# EAGLE design stm32f103cb_lcd32 (EAGLE 6.6.0)
LCD demo module strip
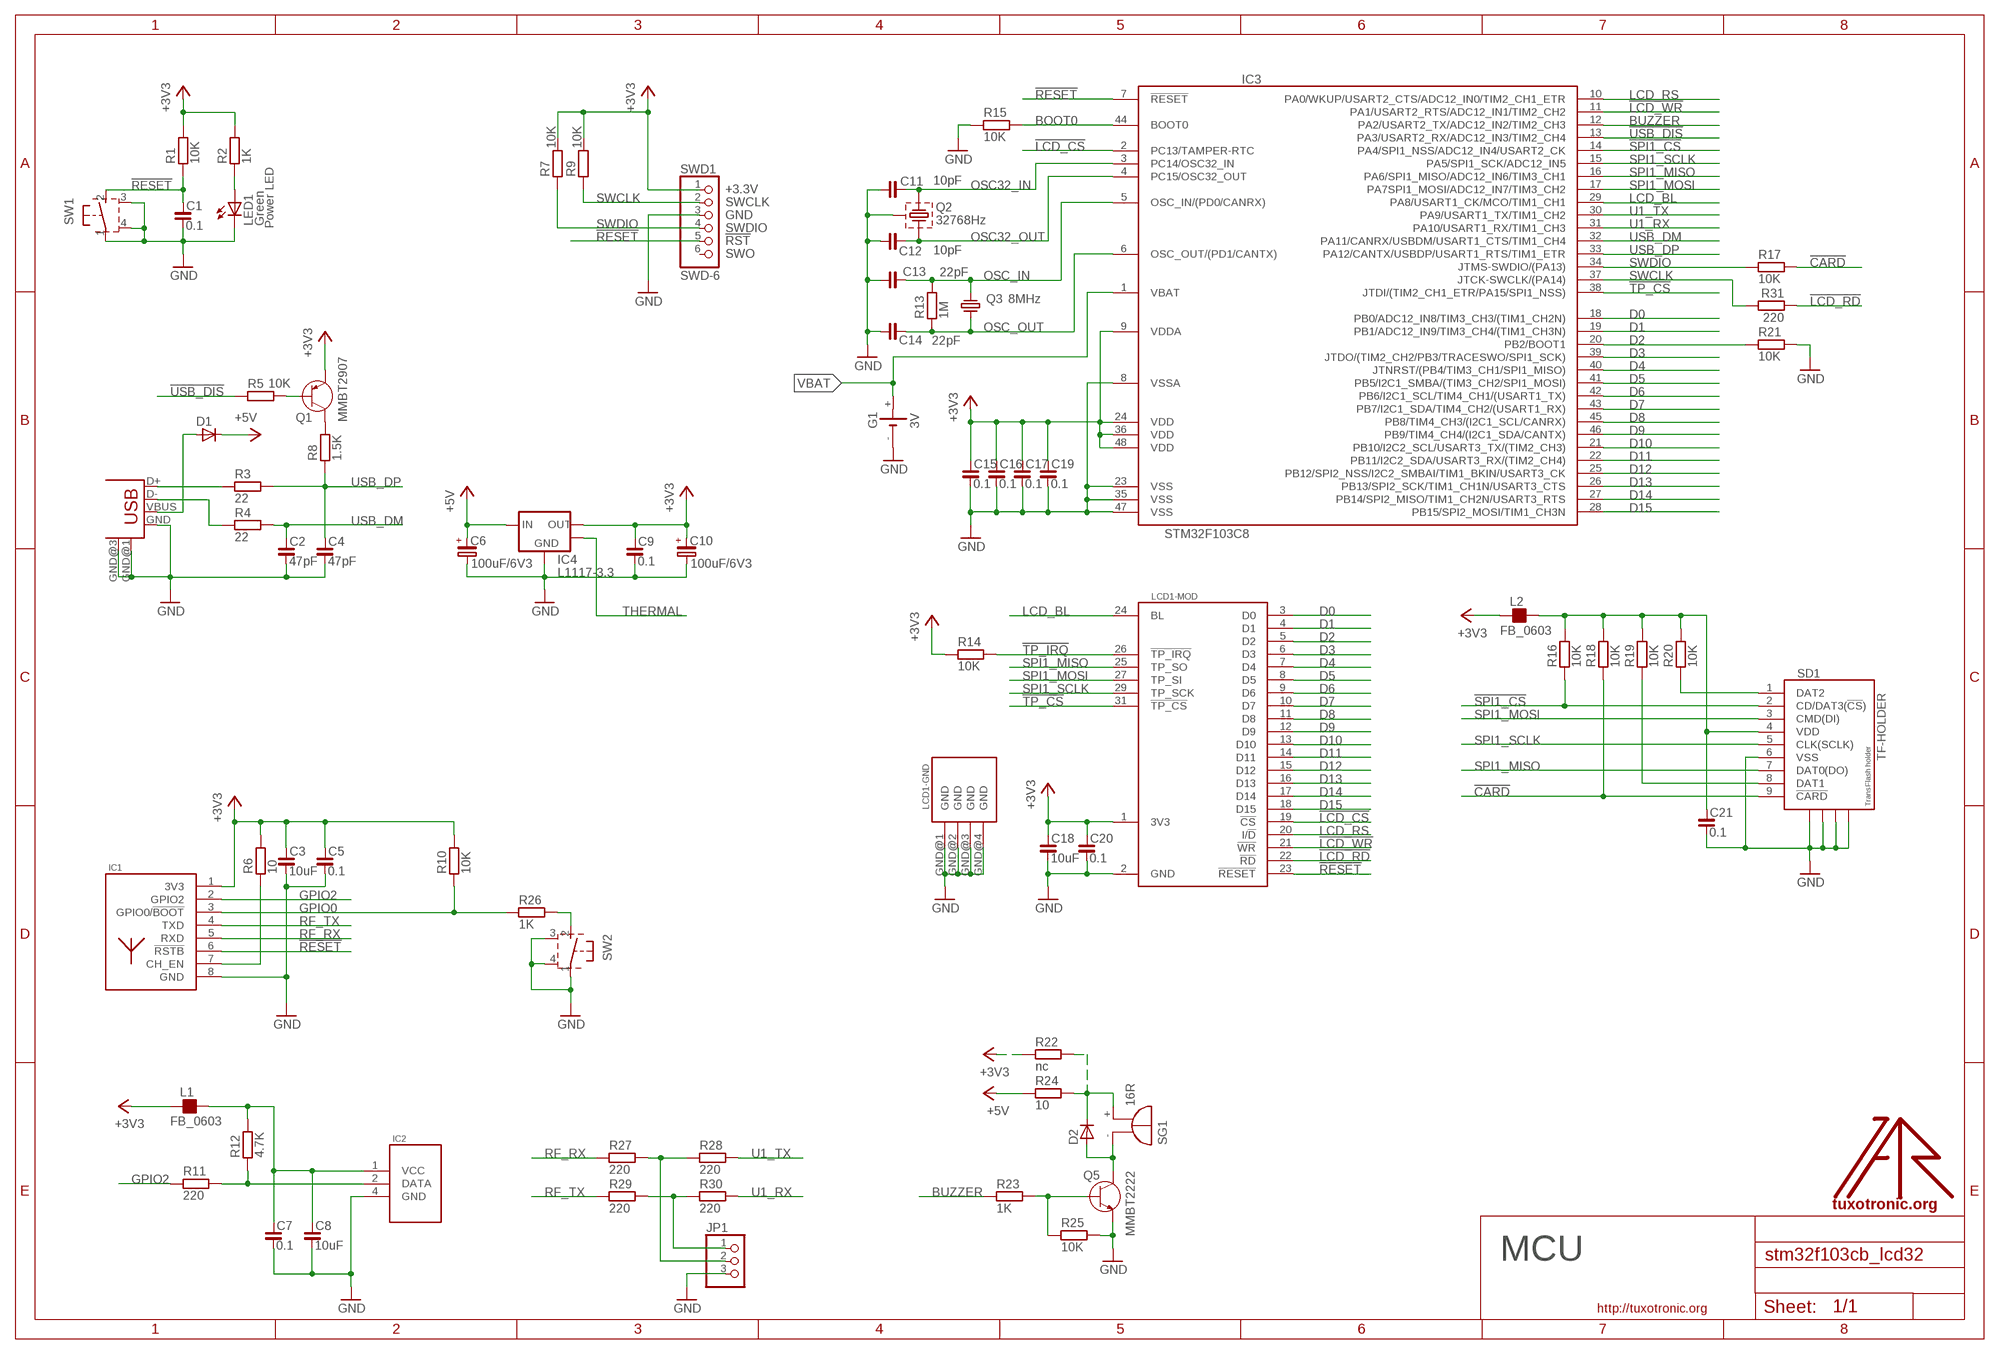
[diagram p0: schematic, sheet 1]

## Parts
C1  0.1  C_0603  [C0603]
C2  47pF  C_0603  [C0603]
C3  10uF  C_0805  [C0805]
C4  47pF  C_0603  [C0603]
C5  0.1  C_0603  [C0603]
C6  100uF/6V3  CP_SMCD  [SMC_D]
C7  0.1  C_0603  [C0603]
C8  10uF  C_0805  [C0805]
C9  0.1  C_0805  [C0805]
C10  100uF/6V3  CP_SMCD  [SMC_D]
C11  10pF  C_0603  [C0603]
C12  10pF  C_0603  [C0603]
C13  22pF  C_0603  [C0603]
C14  22pF  C_0603  [C0603]
C15  0.1  C_0603  [C0603]
C16  0.1  C_0603  [C0603]
C17  0.1  C_0603  [C0603]
C18  10uF  C_0805  [C0805]
C19  0.1  C_0603  [C0603]
C20  0.1  C_0603  [C0603]
C21  0.1  C_0603  [C0603]
D1  D-SMB  [SMB]
D2  D-SOD-80  [SOD80]
G1  3V  1220SMT  [SMT1220]
IC1  ESP-11  [ESP11]
IC2  DHT22  [DHT]
IC3  STM32F103C8  [LQFP48]
IC4  L1117-3.3  LM1117-THP  [SOT223-THP]
JP1  PINHD-1X3_2.54S  [1X03SMALL]
L1  FB_0603  [L0603]
L2  FB_0603  [L0603]
LCD1  YX32B  [YX32B]
LED1  Green  LEDCHIP-LED0805  [CHIP-LED0805]
LOGO1  LOGO  [TT_LOGO]
Q1  MMBT2907  PNP-SOT23  [SOT23]
Q2  32768Hz  CRSTL3-  [TC38H-G]
Q3  8MHz  CRYSTAL-HC49S  [HC49/S]
Q5  MMBT2222  [SOT23]
R1  10K  R_0603  [R0603]
R2  1K  R_0603  [R0603]
R3  22  R_0603  [R0603]
R4  22  R_0603  [R0603]
R5  10K  R_0603  [R0603]
R6  10  R_0603  [R0603]
R7  10K  R_0603  [R0603]
R8  1.5K  R_0603  [R0603]
R9  10K  R_0603  [R0603]
R10  10K  R_0603  [R0603]
R11  220  R_0603  [R0603]
R12  4.7K  R_0603  [R0603]
R13  1M  R_0603  [R0603]
R14  10K  R_0603  [R0603]
R15  10K  R_0603  [R0603]
R16  10K  R_0603  [R0603]
R17  10K  R_0603  [R0603]
R18  10K  R_0603  [R0603]
R19  10K  R_0603  [R0603]
R20  10K  R_0603  [R0603]
R21  10K  R_0603  [R0603]
R22  nc  R_0603  [R0603]
R23  1K  R_0603  [R0603]
R24  10  R_0603  [R0603]
R25  10K  R_0603  [R0603]
R26  1K  R_0603  [R0603]
R27  220  R_0603  [R0603]
R28  220  R_0603  [R0603]
R29  220  R_0603  [R0603]
R30  220  R_0603  [R0603]
R31  220  R_0603  [R0603]
SD1  TF-HOLDER  [TF-PULL]
SG1  16R  F/QMBIII  [F/QMBIII]
SW1  31-XX  [B3F-31XX]
SW2  31-XX  [B3F-31XX]
SWD1  SWD-6  [JTAG6PIN]
USB1  USB-MB-S  [USB-MB-S]

## Nets
!CARD: R17.2 R18.1 SD1.9(!CARD)
!LCD_CS: IC3.2(PC13/TAMPER-RTC) LCD1.19(-MOD:!CS)
!LCD_RD: LCD1.22(-MOD:!RD) R31.1
!LCD_WR: IC3.11(PA1/USART2_RTS/ADC12_IN1/TIM2_CH2) LCD1.21(-MOD:!WR)
!RESET: C1.1 IC1.6(!RSTB) IC3.7(!RESET) LCD1.23(-MOD:!RESET) R1.1 SW1.2(S) SWD1.5
!SPI1_CS: IC3.14(PA4/SPI1_NSS/ADC12_IN4/USART2_CK) R16.1 SD1.2(CD/DAT3(!CS!))
!TP_CS: IC3.38(JTDI/(TIM2_CH1_ETR/PA15/SPI1_NSS)) LCD1.31(-MOD:!TP_CS)
!TP_IRQ: LCD1.26(-MOD:!TP_IRQ) R14.2
!USB_DIS: IC3.13(PA3/USART2_RX/ADC12_IN3/TIM2_CH4) R5.1
+3V3: C3.1 C5.1 C9.1 C10.+ C15.1 C16.1 C17.1 C18.1 C19.1 C20.1 IC1.1(3V3) IC3.9(VDDA) IC3.24(VDD) IC3.36(VDD) IC3.48(VDD) IC4.2(OUT) L1.1 L2.1 LCD1.1(-MOD:3V3) Q1.2(E) R1.2 R2.2 R6.2 R7.2 R9.2 R10.2 R14.1 R22.1 SWD1.1
+5V: C6.+ D1.1(C) IC4.3(IN) R24.1
BOOT0: IC3.44(BOOT0) R15.2
BUZZER: IC3.12(PA2/USART2_TX/ADC12_IN2/TIM2_CH3) R23.1
D0: IC3.18(PB0/ADC12_IN8/TIM3_CH3/(TIM1_CH2N)) LCD1.3(-MOD:D0)
D1: IC3.19(PB1/ADC12_IN9/TIM3_CH4/(TIM1_CH3N)) LCD1.4(-MOD:D1)
D2: IC3.20(PB2/BOOT1) LCD1.5(-MOD:D2) R21.1
D3: IC3.39(JTDO/(TIM2_CH2/PB3/TRACESWO/SPI1_SCK)) LCD1.6(-MOD:D3)
D4: IC3.40(JTNRST/(PB4/TIM3_CH1/SPI1_MISO)) LCD1.7(-MOD:D4)
D5: IC3.41(PB5/I2C1_SMBA/(TIM3_CH2/SPI1_MOSI)) LCD1.8(-MOD:D5)
D6: IC3.42(PB6/I2C1_SCL/TIM4_CH1/(USART1_TX)) LCD1.9(-MOD:D6)
D7: IC3.43(PB7/I2C1_SDA/TIM4_CH2/(USART1_RX)) LCD1.10(-MOD:D7)
D8: IC3.45(PB8/TIM4_CH3/(I2C1_SCL/CANRX)) LCD1.11(-MOD:D8)
D9: IC3.46(PB9/TIM4_CH4/(I2C1_SDA/CANTX)) LCD1.12(-MOD:D9)
D10: IC3.21(PB10/I2C2_SCL/USART3_TX/(TIM2_CH3)) LCD1.13(-MOD:D10)
D11: IC3.22(PB11/I2C2_SDA/USART3_RX/(TIM2_CH4)) LCD1.14(-MOD:D11)
D12: IC3.25(PB12/SPI2_NSS/I2C2_SMBAI/TIM1_BKIN/USART3_CK) LCD1.15(-MOD:D12)
D13: IC3.26(PB13/SPI2_SCK/TIM1_CH1N/USART3_CTS) LCD1.16(-MOD:D13)
D14: IC3.27(PB14/SPI2_MISO/TIM1_CH2N/USART3_RTS) LCD1.17(-MOD:D14)
D15: IC3.28(PB15/SPI2_MOSI/TIM1_CH3N) LCD1.18(-MOD:D15)
GND: C1.2 C2.2 C3.2 C4.2 C5.2 C6.- C7.2 C8.2 C9.2 C10.- C11.2 C12.2 C13.2 C14.2 C15.2 C16.2 C17.2 C18.2 C19.2 C20.2 C21.2 G1.- IC1.8(GND) IC2.4(GND) IC3.8(VSSA) IC3.23(VSS) IC3.35(VSS) IC3.47(VSS) IC4.1(GND) JP1.3 LCD1.2(-MOD:GND) LCD1.GND@1(-GND:GND) LCD1.GND@2(-GND:GND) LCD1.GND@3(-GND:GND) LCD1.GND@4(-GND:GND) LED1.C Q2.GND Q5.2(E) R15.1 R21.2 R25.2 SD1.6(VSS) SD1.S1 SD1.S2 SD1.S3 SD1.S4 SW1.1(P) SW1.3(GND1) SW1.4(GND2) SW2.1(P) SW2.3(GND1) SW2.4(GND2) SWD1.3 USB1.GND USB1.GND@1(GND) USB1.GND@3(GND)
GPIO0: IC1.3(GPIO0/!BOOT) R10.1 R26.1
GPIO2: IC1.2(GPIO2) R11.1
LCD_BL: IC3.29(PA8/USART1_CK/MCO/TIM1_CH1) LCD1.24(-MOD:BL)
LCD_RS: IC3.10(PA0/WKUP/USART2_CTS/ADC12_IN0/TIM2_CH1_ETR) LCD1.20(-MOD:I/!D)
N$1: Q1.3(C) R8.2
N$2: D1.2(A) USB1.VBUS
N$3: LED1.A R2.1
N$4: Q5.1(B) R23.2 R25.1
N$5: IC1.7(CH_EN) R6.1
N$6: IC2.2(DATA) R11.2 R12.1
N$7: C21.1 L2.2 R16.2 R18.2 R19.2 R20.2 SD1.4(VDD)
N$8: R20.1 SD1.1(DAT2)
N$9: R19.1 SD1.8(DAT1)
N$10: R3.1 USB1.D+
N$11: C7.1 C8.1 IC2.1(VCC) L1.2 R12.2
N$12: D2.2(A) Q5.3(C) SG1.-(+)
N$15: D2.1(C) R22.2 R24.2 SG1.+(-)
N$16: R26.2 SW2.2(S)
N$18: JP1.1 R29.2 R30.1
N$20: JP1.2 R27.2 R28.1
N$36: R4.1 USB1.D-
N$38: Q1.1(B) R5.2
OSC32_IN: C11.1 IC3.3(PC14/OSC32_IN) Q2.2
OSC32_OUT: C12.1 IC3.4(PC15/OSC32_OUT) Q2.1
OSC_IN: C13.1 IC3.5(OSC_IN/(PD0/CANRX)) Q3.1 R13.2
OSC_OUT: C14.1 IC3.6(OSC_OUT/(PD1/CANTX)) Q3.2 R13.1
RF_RX: IC1.5(RXD) R27.1
RF_TX: IC1.4(TXD) R29.1
SPI1_MISO: IC3.16(PA6/SPI1_MISO/ADC12_IN6/TIM3_CH1) LCD1.25(-MOD:TP_SO) SD1.7(DAT0(DO))
SPI1_MOSI: IC3.17(PA7SPI1_MOSI/ADC12_IN7/TIM3_CH2) LCD1.27(-MOD:TP_SI) SD1.3(CMD(DI))
SPI1_SCLK: IC3.15(PA5/SPI1_SCK/ADC12_IN5) LCD1.29(-MOD:TP_SCK) SD1.5(CLK(SCLK))
SWCLK: IC3.37(JTCK-SWCLK/(PA14)) R9.1 R31.2 SWD1.2
SWDIO: IC3.34(JTMS-SWDIO/(PA13)) R7.1 R17.1 SWD1.4
THERMAL: IC4.4(MASS)
U1_RX: IC3.31(PA10/USART1_RX/TIM1_CH3) R30.2
U1_TX: IC3.30(PA9/USART1_TX/TIM1_CH2) R28.2
USB_DM: C2.1 IC3.32(PA11/CANRX/USBDM/USART1_CTS/TIM1_CH4) R4.2
USB_DP: C4.1 IC3.33(PA12/CANTX/USBDP/USART1_RTS/TIM1_ETR) R3.2 R8.1
VBAT: G1.+ IC3.1(VBAT)
Unconnected: SWD1.6

## Notes on the sheet
- Power LED
- MCU

## Library data of the parts
C1-C5 C7-C9 C11-C21 = rc-master-smd:C_: NON-POLARIZED CAP
C6 C10 = rc-master-smd:CP_: POLARIZED CAP
D1 D2 = semicon-smd-ipc:D-: DIODE unfilled
G1 = battery:1220SMT
IC1 = esp-modules:ESP-11
IC2 = temperature_sensor:DHT22: Digital-output relative humidity & temperature sensor/module DHT22 (DHT22 also named as AM2302) Power supply: 3.3-6V DC Sensing element: Polymer capacitor Range: -40~80C; 0-100%RH; Accuracy: +-0.5C; +-2%RH(Max +-5%RH)
IC3 = stm32:STM32F103C
IC4 = vreg-linear:LM1117: Linear regulators
JP1 = pinhead-fixdrills:PINHD-1X3: PIN HEADER
L1 L2 = rc-master-smd:FB_: FERRITE BEAD
LCD1 = lcd:YX32B: Key features Model :YX32B LCD Controller : SSD1289 Touch Screen Controller: ADS7843 LCD Type: TFT LCD Interface: 16-bit parallel Touch Screen Interface: SPI Backlight: LED Colors: 65536 Resolution: 320*240 DOTS Interface PIN NO. SYMBOL DESCRIPTION FUNCTION 1 3.3V 3.3V power supply Powered from 3.3V supply, 2 GND Ground GND 3 D0 Data lines D0-D15 4 D1 5 D2 6 D3 7 D4 8 D5 9 D6 10 D7 11 D8 12 D9 13 D10 14 D11 15 D12 16 D13 17 D14 18 D15 19 CS LCD chip select Low active 20 RS Instruction/Data register selection RS = 1 : Instruction Register RS = 0 : Data Register 21 WR Write WR = 0, RD = 1 22 RD Read WR = 1, RD = 0 23 RESET Reset the controller chip Low active 24 BLCNT Backlight brightness adjustment Control the backlight brightness via PWM 25 TP_SO Touch screen SPI data output connects to SPI MISO 26 TP_IRQ Touch screen interrupt Low level while the touch screen detects pressing 27 TP_SI Touch screen data input connects to SPI MOSI 28 TE Dangling Dangling 29 TP_SCK Touch screen SPI clock connects to SPI SCK 30 TE Dangling Dangling 31 TP_CS Touch screen chip select Low active 32 TE Dangling Dangling
LED1 = led:LED: LED OSRAM: - CHIPLED LG R971, LG N971, LY N971, LG Q971, LY Q971, LO R971, LY R971 LH N974, LH R974 LS Q976, LO Q976, LY Q976 LO Q996 - Hyper CHIPLED LW Q18S LB Q993, LB Q99A, LB R99A - SideLED LS A670, LO A670, LY A670, LG A670, LP A670 LB A673, LV A673, LT A673, LW A673 LH A674 LY A675 LS A676, LA A676, LO A676, LY A676, LW A676 LS A679, LY A679, LG A679 - Hyper Micro SIDELED® LS Y876, LA Y876, LO Y876, LY Y876 LT Y87S - SmartLED LW L88C, LW L88S LB L89C, LB L89S, LG L890 LS L89K, LO L89K, LY L89K LS L896, LA L896, LO L896, LY L896 - TOPLED LS T670, LO T670, LY T670, LG T670, LP T670 LSG T670, LSP T670, LSY T670, LOP T670, LYG T670 LG T671, LOG T671, LSG T671 LB T673, LV T673, LT T673, LW T673 LH T674 LS T676, LA T676, LO T676, LY T676, LB T676, LH T676, LSB T676, LW T676 LB T67C, LV T67C, LT T67C, LS T67K, LO T67K, LY T67K, LW E67C LS E67B, LA E67B, LO E67B, LY E67B, LB E67C, LV E67C, LT E67C LW T67C LS T679, LY T679, LG T679 LS T770, LO T770, LY T770, LG T770, LP T770 LB T773, LV T773, LT T773, LW T773 LH T774 LS E675, LA E675, LY E675, LS T675 LS T776, LA T776, LO T776, LY T776, LB T776 LHGB T686 LT T68C, LB T68C - Hyper Mini TOPLED® LB M676 - Mini TOPLED Santana® LG M470 LS M47K, LO M47K, LY M47K Source: http://www.osram.convergy.de - LUMILED® LXK2-PW12-R00, LXK2-PW12-S00, LXK2-PW14-U00, LXK2-PW14-V00 LXK2-PM12-R00, LXK2-PM12-S00, LXK2-PM14-U00 LXK2-PE12-Q00, LXK2-PE12-R00, LXK2-PE12-S00, LXK2-PE14-T00, LXK2-PE14-U00 LXK2-PB12-K00, LXK2-PB12-L00, LXK2-PB12-M00, LXK2-PB14-N00, LXK2-PB14-P00, LXK2-PB14-Q00 LXK2-PR12-L00, LXK2-PR12-M00, LXK2-PR14-Q00, LXK2-PR14-R00 LXK2-PD12-Q00, LXK2-PD12-R00, LXK2-PD12-S00 LXK2-PH12-R00, LXK2-PH12-S00 LXK2-PL12-P00, LXK2-PL12-Q00, LXK2-PL12-R00 Source: www.luxeon.com
LOGO1 = logo:LOGO
Q1 = semiconductor:PNP-
Q2 = crystal:CRSTL3-
Q3 = discrete:CRYSTAL-: CRYSTAL
Q5 = semiconductor:MMBT2222: General Purpose Transistors NPN Silicon Rating MMBT2222LT1G MMBT2222ALT1G Collector-Emitter Voltage (VCEO) 30 Vdc 40 Vdc Collector-Base Voltage (VCBO) 60 Vdc 75 Vdc Emitter-Base Voltage (VEBO) 5.0 Vdc 6.0 Vdc Collector Current Continuous (IC) 600 mAdc 1100 mAdc Collector Current Peak (ICM) 600 mAdc 1100 mAdc
R1-R31 = rc-master-smd:R_: RESISTOR
SD1 = sd-mmc:TF-HOLDER: TF / Micro SD socket is PUSH-PUSH type, the card can be pushed into and auto locked and pushed out by simply press the card. Surface Mounting type.
SG1 = buzzer:F/QMBIII: BUZZER Source: Buerklin
SW1 SW2 = buttons:31-XX: OMRON SWITCH
SWD1 = jtag:SWD-6: STM32Fx Discovery
USB1 = usb:USB: USB Connectors

## Net classes
0 default: width 0.1 mm, drill 0.1 mm, clearance 0.1 mm

## Board
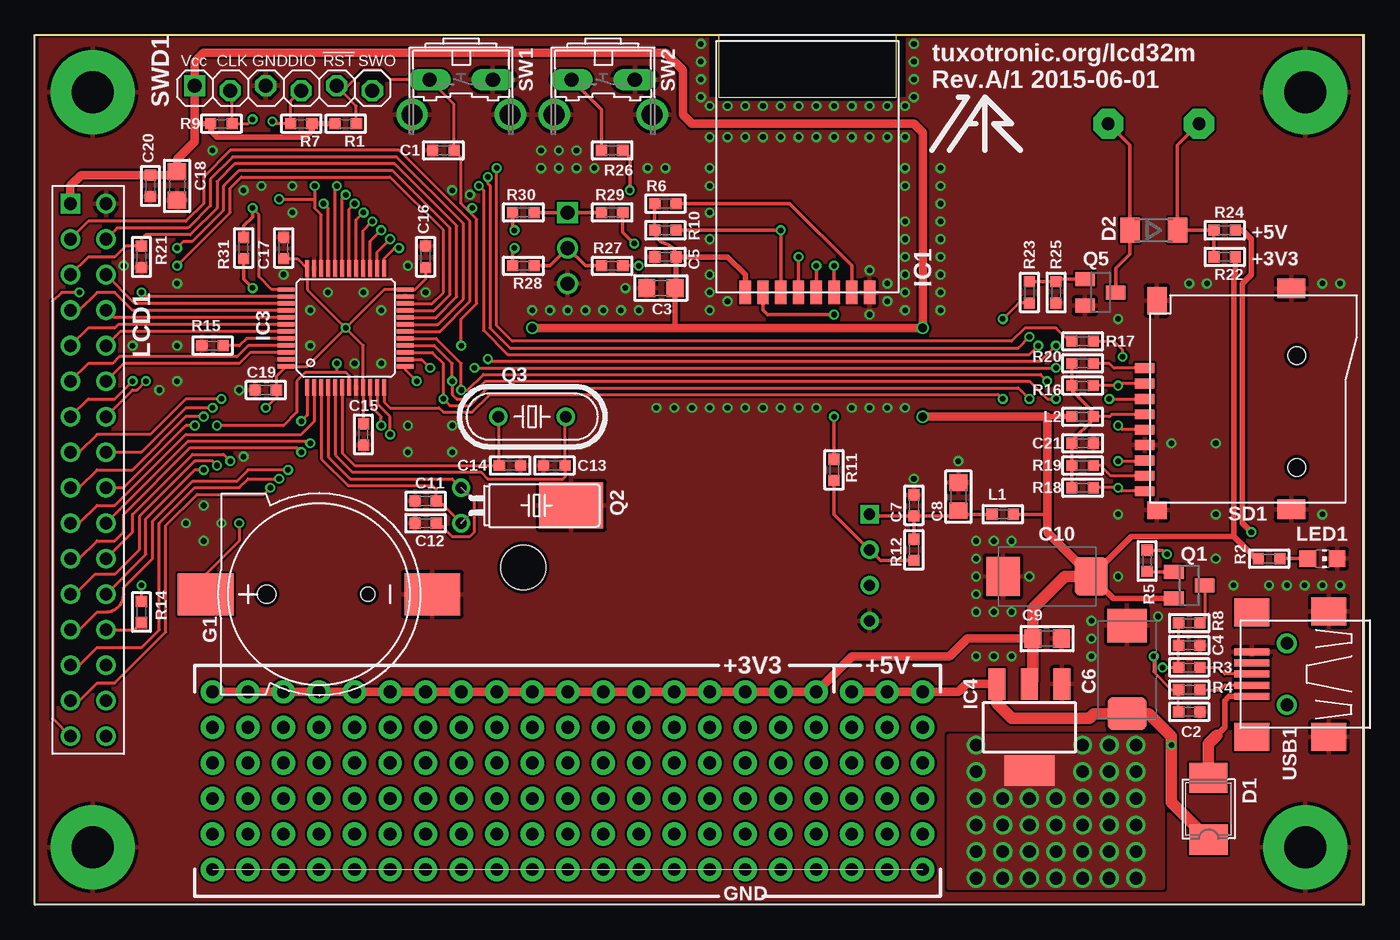
[diagram p1: board, top side]
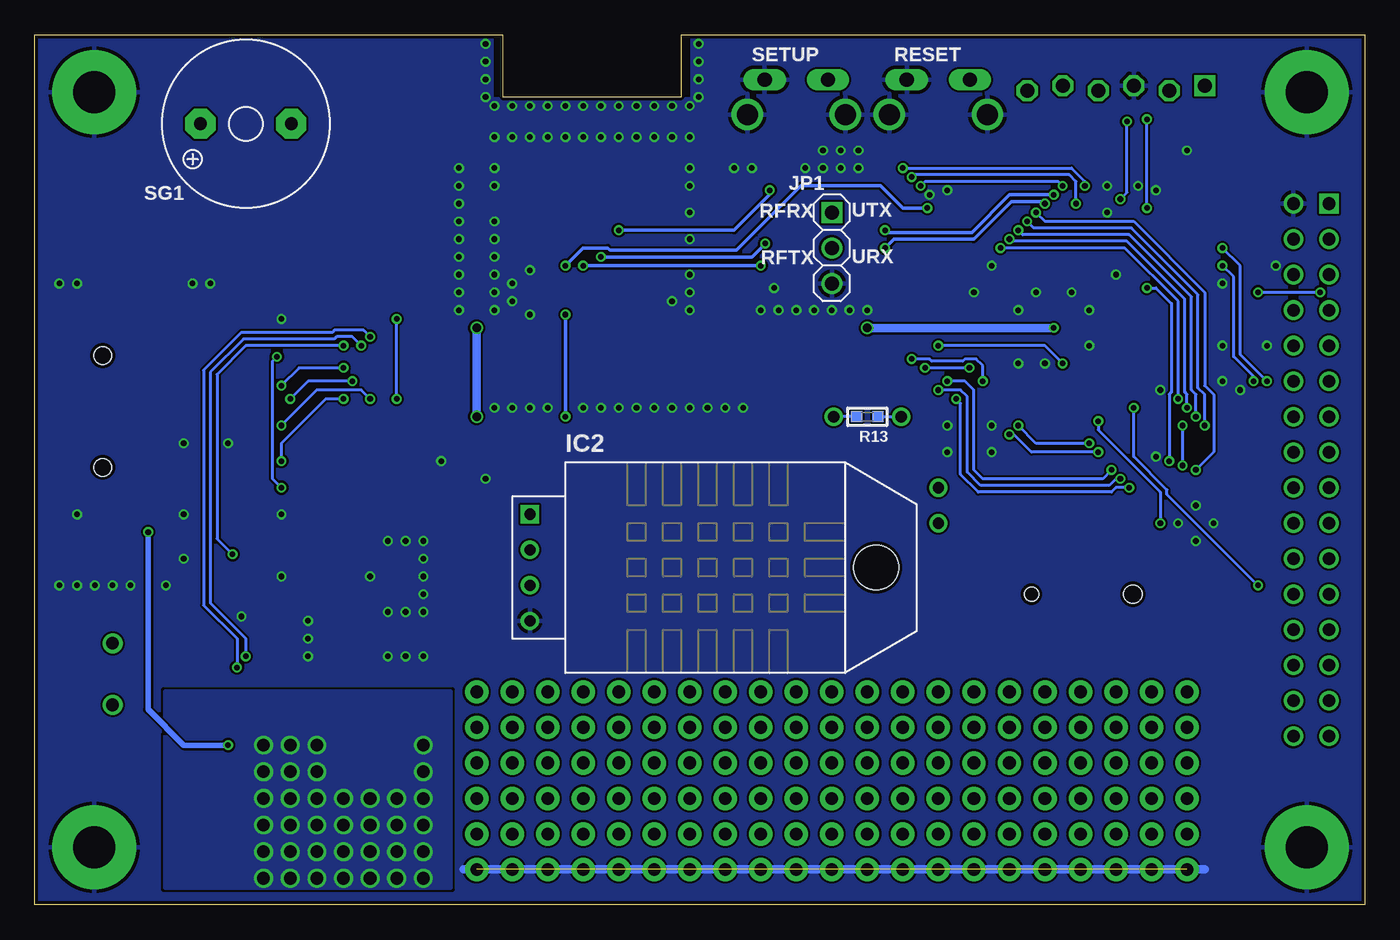
[diagram p2: board, bottom side, seen from below]

Size 95.09 x 62.23 mm. Coordinates in mm from the lower left corner, seen from the top.
Outline: 0,0 95.09,0 95.09,62.23 61.59,62.23 61.59,57.78 48.9,57.78 48.9,62.23 0,62.23 0,0
Copper layers (1*16): Top 0.035mm / dielectric 1.5mm / Bottom 0.035mm
Design rules "SeeedStudio_2layer_DRU_no_angle_20140221 *": minimum track width 6mil, minimum drill 12mil, track to track 6mil, track to pad 6mil, pad to pad 6mil, via to via 6mil, smd to smd 0mil, copper to edge 10mil, drill to drill 10mil, minimum pad ring 10mil, minimum via ring 6mil, stop-mask expansion 2mil, vias tented up to drill 0.8mm, thermal gap 10mil

### Footprints (pad centres in the part's own frame; a part is rotated, then mirrored left to right if it is on the bottom)
C0603 = smd 0.8 x 0.8: 1 -0.762,0; 2 0.762,0
C0805 = smd 1.2 x 1.3: 1 -1.016,0; 2 1.016,0
SMC_D = smd 2.4 x 2.8: + -3.15,0; - 3.15,0
SMB = smd 2.159 x 2.743: 1 -2.311,-0.127; 2 2.108,-0.102
SOD80 = smd 1.4 x 1.8: 1 -1.7,0; 2 1.7,0
SMT1220 = smd 4 x 3: + -8.1,0; - 8.1,0 | hole 1: 3.5,0 | hole 1.3: -3.75,0
ESP11 = smd 1.676 x 0.813: 1 0,-4.445; 2 0,-3.175; 3 0,-1.905; 4 0,-0.635; 5 0,0.635; 6 0,1.905; 7 0,3.175; 8 0,4.445
DHT = drill 0.8 square: 1 -3.81,-2.54 | drill 0.8: 2 -1.27,-2.54; 3 1.27,-2.54; 4 3.81,-2.54 | hole 3.2: 0,22.225
LQFP48 = smd 0.3 x 1.2: 1 -2.75,-4.25; 2 -2.25,-4.25; 3 -1.75,-4.25; 4 -1.25,-4.25; 5 -0.75,-4.25; 6 -0.25,-4.25; 7 0.25,-4.25; 8 0.75,-4.25; 9 1.25,-4.25; 10 1.75,-4.25; 11 2.25,-4.25; 12 2.75,-4.25; 25 2.75,4.25; 26 2.25,4.25; 27 1.75,4.25; 28 1.25,4.25; 29 0.75,4.25; 30 0.25,4.25; 31 -0.25,4.25; 32 -0.75,4.25; 33 -1.25,4.25; 34 -1.75,4.25; 35 -2.25,4.25; 36 -2.75,4.25 | smd 1.2 x 0.3: 13 4.25,-2.75; 14 4.25,-2.25; 15 4.25,-1.75; 16 4.25,-1.25; 17 4.25,-0.75; 18 4.25,-0.25; 19 4.25,0.25; 20 4.25,0.75; 21 4.25,1.25; 22 4.25,1.75; 23 4.25,2.25; 24 4.25,2.75; 37 -4.25,2.75; 38 -4.25,2.25; 39 -4.25,1.75; 40 -4.25,1.25; 41 -4.25,0.75; 42 -4.25,0.25; 43 -4.25,-0.25; 44 -4.25,-0.75; 45 -4.25,-1.25; 46 -4.25,-1.75; 47 -4.25,-2.25; 48 -4.25,-2.75
SOT223-THP = smd 1.219 x 2.235: 1 -2.311,-3.099; 2 0,-3.099; 3 2.311,-3.099 | smd 3.6 x 2.2: 4 0,3.099
1X03SMALL = drill 1 square: 1 -2.54,0 | drill 1: 2 0,0; 3 2.54,0
L0603 = smd 0.8 x 0.8: 1 -0.762,0; 2 0.762,0
YX32B = drill 0.9 square: 1 -1.27,19.05 | drill 0.9: 2 1.27,19.05; 3 -1.27,16.51; 4 1.27,16.51; 5 -1.27,13.97; 6 1.27,13.97; 7 -1.27,11.43; 8 1.27,11.43; 9 -1.27,8.89; 10 1.27,8.89; 11 -1.27,6.35; 12 1.27,6.35; 13 -1.27,3.81; 14 1.27,3.81; 15 -1.27,1.27; 16 1.27,1.27; 17 -1.27,-1.27; 18 1.27,-1.27; 19 -1.27,-3.81; 20 1.27,-3.81; 21 -1.27,-6.35; 22 1.27,-6.35; 23 -1.27,-8.89; 24 1.27,-8.89; 25 -1.27,-11.43; 26 1.27,-11.43; 27 -1.27,-13.97; 28 1.27,-13.97; 29 -1.27,-16.51; 30 1.27,-16.51; 31 -1.27,-19.05; 32 1.27,-19.05 | drill 3 pad 6: GND@1 0.31,-26.995; GND@2 87.04,-26.995; GND@3 0.31,27.005; GND@4 87.04,27.005
CHIP-LED0805 = smd 1.2 x 1.2: A 0,-1.05; C 0,1.05
SOT23 = smd 1 x 1.4: 1 -0.95,-1.1; 2 0.95,-1.1; 3 0,1.1
TC38H-G = drill 0.8: 1 -1.27,0; 2 1.27,0 | smd 3.302 x 4.572: GND 0,7.874
HC49/S = drill 0.813: 1 -2.413,0; 2 2.413,0
R0603 = smd 0.8 x 0.8: 1 -0.762,0; 2 0.762,0
TF-PULL = smd 0.7 x 1.4: 1 -2.2,-7.62; 2 -1.1,-7.62; 3 0,-7.62; 4 1.1,-7.62; 5 2.2,-7.62; 6 3.3,-7.62; 7 4.4,-7.62; 8 5.5,-7.62; 9 6.6,-7.62 | smd 1.4 x 2: S1 -7.9,2.85; S2 7.9,2.85 | smd 1.28 x 1.4: S3 7.96,-6.75 | smd 1.95 x 1.4: S4 -7.025,-6.75 | hole 1.25: -3.1,3.25; 4.9,3.25
F/QMBIII = drill 0.9 pad 2.159 octagon: + 3.251,0; - -3.251,0
B3F-31XX = drill 1.016 long: 1 -2.261,-1.245; 2 2.261,-1.245 | drill 1.499 pad 2.159: 3 -3.505,1.245; 4 3.505,1.245
JTAG6PIN = drill 1 square: 1 -6.35,0.178 | drill 1 octagon: 2 -3.81,-0.178; 3 -1.27,0.178; 4 1.27,-0.178; 5 3.81,0.178; 6 6.35,-0.178
USB-MB-S = smd 2.5 x 0.5: D+ 2.5,0; D- 2.5,0.8; GND 2.5,-1.6; ID 2.5,-0.8; VBUS 2.5,1.6 | smd 2.5 x 2: GND@1 -3,4.5; GND@2 2.5,4.5; GND@3 -3,-4.5; GND@4 2.5,-4.4 | drill 0.9: P$5 0,2.2; P$6 0,-2.2

### Placement (x,y rotation side)
C1  29.21,53.98 180 top
C2  82.55,13.81 0 top
C3  44.77,44.13 180 top
C4  82.55,18.57 0 top
C5  45.09,46.35 180 top
C6  78.11,16.83 90 top
C7  62.87,28.57 90 top
C8  66.04,29.21 90 top
C9  72.39,19.05 0 top
C10  72.39,23.5 180 top
C11  27.94,28.89 180 top
C12  27.94,27.3 180 top
C13  37.15,31.43 180 top
C14  33.97,31.43 0 top
C15  23.5,33.66 270 top
C16  27.94,46.35 90 top
C17  17.78,46.99 90 top
C18  10.16,51.44 270 top
C19  16.51,36.83 180 top
C20  8.26,51.44 270 top
C21  74.93,33.02 0 top
D1  83.82,6.99 90 top
D2  80.01,48.26 180 top
G1  20.32,22.23 0 top
IC1  55.24,43.81 270 top
IC2  57.15,24.13 270 bottom
IC3  22.23,41.27 0 top
IC4  71.12,12.7 180 top
JP1  38.1,46.99 270 bottom
L1  69.22,27.94 180 top
L2  74.93,34.92 0 top
LCD1  3.81,31.11 0 top
LED1  92.08,24.77 270 top
LOGO1  67.94,56.52 0 top
Q1  82.55,22.86 270 top
Q2  30.48,28.57 270 top
Q3  35.56,34.92 180 top
Q5  76.2,43.81 270 top
R1  22.23,55.88 180 top
R2  88.27,24.77 180 top
R3  82.55,16.99 180 top
R4  82.55,15.4 180 top
R5  79.53,24.61 270 top
R6  45.09,50.16 180 top
R7  19.05,55.88 0 top
R8  82.55,20.16 0 top
R9  13.34,55.88 180 top
R10  45.09,48.26 180 top
R11  57.15,31.11 270 top
R12  62.87,25.4 90 top
R13  35.56,34.92 180 bottom
R14  7.62,20.95 270 top
R15  12.7,40.01 0 top
R16  74.93,37.15 180 top
R17  74.93,40.32 0 top
R18  74.93,29.84 180 top
R19  74.93,31.43 180 top
R20  74.93,38.73 180 top
R21  7.62,46.35 270 top
R22  85.09,46.35 180 top
R23  71.12,43.81 90 top
R24  85.09,48.26 180 top
R25  73.03,43.81 270 top
R26  41.27,53.98 180 top
R27  41.27,45.72 180 top
R28  34.92,45.72 180 top
R29  41.27,49.53 180 top
R30  34.92,49.53 180 top
R31  14.92,46.99 90 top
SD1  87,36.2 270 top
SG1  80.01,55.88 180 bottom
SW1  30.48,57.78 180 top
SW2  40.64,57.78 180 top
SWD1  17.78,58.42 0 top
USB1  89.53,16.51 180 top

### Tracks (layer width: path | path; a pad name or v marks a point on that pad's centre or on a via)
!CARD  (via drill 0.4)
  Top 0.203: SD1.9 77.72,29.59 v77.47,29.84 R18.1 75.69,29.81 | v77.79,39.21 77.79,39.69 77.15,40.32 R17.2
  Bottom 0.203: v77.47,29.84 78.11,30.48 78.11,38.89 v77.79,39.21
!LCD_CS
  Top 0.203: LCD1.19 3.17,27.3 4.45,28.57 5.71,28.57 10.79,33.66 19.05,33.66 19.98,34.58 IC3.2
!LCD_RD  (via drill 0.4)
  Top 0.203: LCD1.22 6.99,26.67 6.99,27.94 11.27,32.23 13.49,32.23 v13.97,31.75
  Top 0.254: R31.1 14.92,44.77 v15.56,44.13
  Bottom 0.203: v15.56,44.13 14.92,44.13 13.81,43.02 13.81,36.67 13.97,36.51 v13.97,31.75
!LCD_WR  (via drill 0.4)
  Top 0.203: LCD1.21 3.17,24.77 4.45,26.04 5.71,26.04 6.35,26.67 6.35,27.94 11.11,32.7 18.73,32.7 v19.05,32.38 | v25.4,33.66 25.4,34.92 24.48,35.85 IC3.11
  Bottom 0.203: v19.05,32.38 23.81,32.38 25.08,33.66 v25.4,33.66
!RESET  (via drill 0.4)
  Top 0.203: R1.1 22.99,57.15 SWD1.5 22.35,58.55 23.5,59.69 24.77,59.69 25.43,59.03 SW1.2 29.97,57.28 C1.1 30.48,53.47 30.48,50.16 31.11,49.53 | IC3.7 22.48,37.85 22.23,38.1 21.59,38.1 | v13.02,34.29 17.78,34.29 18.73,35.24 18.73,37.47 19.37,38.1 21.59,38.1 | v13.02,31.43 12.7,31.75 11.43,31.75 7.46,27.78 7.46,25.4 5.71,23.65 4.29,23.65 2.86,22.23 LCD1.23 | v30.48,40.01 30.48,41.91 31.59,43.02 31.59,49.05 31.11,49.53 | v31.27,49.85 31.11,49.53 | v21.59,38.73 21.59,38.1
  Top 0.254: IC1.6 v57.15,45.72
  Bottom 0.203: v13.02,34.29 v13.02,31.43 | v30.48,40.01 22.86,40.01 v21.59,38.73
  Bottom 0.254: v57.15,45.72 55.88,46.99 54.13,46.99 53.98,46.83 44.93,46.83 40.32,51.44 34.61,51.44 33.02,49.85 v31.27,49.85
!SPI1_CS  (via drill 0.4)
  Top 0.203: SD1.2 77.62,37.3 v77.47,37.15 R16.1 | IC3.14 27.65,39.02 v28.26,38.42 | v31.43,38.42 v73.03,38.42
  Bottom 0.203: v28.26,38.42 v31.43,38.42 | v73.03,38.42 76.2,38.42 v77.47,37.15
!TP_CS  (via drill 0.4)
  Top 0.203: IC3.38 7.91,43.52 v7.62,43.81 | v3.17,43.81 1.91,43.81 1.27,43.18 1.27,13.34 LCD1.31
  Bottom 0.203: v3.17,43.81 v7.62,43.81
!TP_IRQ
  Top 0.203: LCD1.26 7.11,19.68 R14.2
!USB_DIS  (via drill 0.4)
  Top 0.203: v73.03,40.01 71.91,38.89 32.54,38.89 v32.38,39.05 | IC3.13 26.48,38.3 v27.3,37.47
  Top 0.254: R5.1 80.61,25.37 v80.96,25.08
  Bottom 0.203: v80.96,25.08 82.07,26.19 82.07,37.94 80.01,40.01 v73.03,40.01 | v27.3,37.47 27.3,38.58 27.78,39.05 28.57,39.05 28.73,38.89 30.96,38.89 31.11,39.05 v32.38,39.05
+3V3  (via drill 0.4, 0.6, 0.9 pad 1.68)
  Top 0.203: C15.1 23.48,34.44 IC3.9 23.48,40.02 v22.23,41.27 | v22.23,41.27 19.48,38.52 IC3.48 17.27,37.82 C19.1 17.27,36.32 v16.51,35.56 | v22.23,41.27 24.98,44.02 IC3.24 27.2,44.02 27.94,44.77 C16.1 | v22.23,41.27 19.48,44.02 IC3.36 18.77,46.23 C17.1 | R14.1 v7.62,22.86
  Top 0.254: R6.2 R10.2 arc77 45.09,47.31 arc-77 C5.1 | L1.1 72.39,27.94
  Top 0.406: 9.91,52.2 C18.1 | 11.43,55.88 R9.2 12.57,55.37 13.02,54.93 19.37,54.93 19.81,55.37 R7.2 R1.2 | L2.1 72.39,34.92 | 45.72,41.27 45.78,41.34 C3.1 45.85,44.2 C5.1 49.53,46.35 50.8,45.09 IC1.1 | 85.72,26.35 85.72,45.09 85.85,45.21 R22.1 | 85.72,26.35 78.4,26.35 C10.+ 77.12,21.91 Q1.2 | R2.2 87.31,24.77 85.72,26.35
  Top 0.61: v63.5,34.92 72.39,34.92 72.39,27.94 72.39,26.64 C10.+ | v35.56,41.27 45.72,41.27 v63.5,41.27 63.5,55.24 62.87,55.88 46.99,55.88 46.35,56.52 46.35,59.69 45.09,60.96 12.06,60.96 11.43,60.33 SWD1.1 11.43,55.88 11.43,54.61 10.16,53.34 C18.1 | 9.91,52.2 C20.1 3.3,52.2 2.54,51.44 LCD1.1 | v12.7,15.24 v15.24,15.24 v17.78,15.24 v20.32,15.24 v22.86,15.24 v25.4,15.24 v27.94,15.24 v30.48,15.24 v33.02,15.24 v35.56,15.24 v38.1,15.24 v40.64,15.24 v43.18,15.24 v45.72,15.24 v48.26,15.24 v50.8,15.24 v53.34,15.24 v55.88,15.24 58.42,17.78 65.41,17.78 66.67,19.05 C9.1
  Top 0.813: C10.+ 73.66,23.5 71.37,21.21 C9.1 71.37,16.05 IC4.2
  Bottom 0.203: v16.51,35.56 16.51,32.07 14.13,29.69 14.13,29.37 v7.62,22.86
  Bottom 0.61: v35.56,41.27 v22.23,41.27 | v63.5,34.92 v63.5,41.27
+5V  (via drill 0.4, 0.9 pad 1.68)
  Top 0.406: R24.1 86.36,48.26 87,47.62 87,45.09 86.36,44.45 86.36,27.3 v87,26.67
  Top 0.61: v58.42,15.24 v60.96,15.24 v63.5,15.24 66.04,15.24 66.6,15.8 IC4.3
  Top 0.813: D1.1 81.28,7.34 v81.28,11.43 81.28,12.06 79.67,13.68 C6.+ 75.75,13.68 75.41,13.34 69.88,13.36 68.81,14.43 IC4.3
  Bottom 0.406: v87,26.67 87,13.97 84.45,11.43 v81.28,11.43
BOOT0
  Top 0.203: IC3.44 15.12,40.52 14.61,40.01 R15.2
BUZZER  (via drill 0.4)
  Top 0.203: IC3.12 24.98,35.98 25.4,35.56 28.89,35.56 29.21,35.24 31.27,35.24 32.54,36.51 68.9,36.51 v69.22,36.2 | v69.22,41.91 70.36,43.05 R23.1
  Bottom 0.203: v69.22,36.2 v69.22,41.91
D0
  Top 0.203: IC3.18 28.96,41.02 31.11,43.18 31.11,48.9 26.04,53.98 13.97,53.98 12.06,52.07 12.06,50.16 10.79,48.9 3.81,48.9 LCD1.3
D1
  Top 0.203: IC3.19 28.82,41.52 30.64,43.34 30.64,48.74 25.88,53.5 14.13,53.5 12.54,51.91 12.54,50.01 10.95,48.42 5.87,48.42 LCD1.4
D2
  Top 0.203: IC3.20 28.69,42.02 30.16,43.5 30.16,48.58 25.72,53.02 14.29,53.02 13.02,51.75 13.02,49.85 11.11,47.94 7.94,47.94 7.62,47.62 R21.1 6.48,47.12 5.71,46.35 3.81,46.35 LCD1.5
D3
  Top 0.203: IC3.39 7.14,43.02 LCD1.6
D4
  Top 0.203: IC3.40 7,42.52 5.71,43.81 4.45,43.81 3.17,42.55 LCD1.7
D5
  Top 0.203: LCD1.8 5.6,42.02 IC3.41
D6
  Top 0.203: LCD1.9 3.81,41.27 5.71,41.27 5.96,41.52 IC3.42
D7
  Top 0.203: LCD1.10 6.1,41.02 IC3.43
D8
  Top 0.203: LCD1.11 3.81,38.73 5.56,38.73 6.03,39.21 14.45,39.21 15.26,40.02 IC3.45
D9
  Top 0.203: LCD1.12 6.35,38.73 14.61,38.73 15.39,39.52 IC3.46
D10  (via drill 0.4)
  Top 0.203: IC3.21 28.55,42.52 29.69,43.66 29.69,48.42 25.56,52.55 14.61,52.55 13.49,51.44 13.49,49.69 11.27,47.47 10.64,47.47 v10.16,46.99 | LCD1.13 3.81,36.2 5.71,36.2 v6.99,37.47
  Bottom 0.203: v6.99,37.47 8.89,39.37 8.89,45.72 v10.16,46.99
D11  (via drill 0.4)
  Top 0.203: IC3.22 28.42,43.02 29.21,43.81 29.21,48.26 25.4,52.07 14.76,52.07 13.97,51.28 13.97,49.53 v10.16,45.72 | LCD1.14 6.99,36.83 7.3,36.83 v7.94,37.47
  Bottom 0.203: v7.94,37.47 7.94,37.78 9.37,39.21 9.37,44.93 v10.16,45.72
D12  (via drill 0.4)
  Top 0.203: IC3.25 24.98,46.25 25.72,46.99 v26.04,46.99 | LCD1.15 3.17,32.38 4.45,33.66 8.26,33.66 10.79,36.2 v13.34,36.2
  Bottom 0.203: v13.34,36.2 13.34,43.18 17.14,46.99 v26.04,46.99
D13  (via drill 0.4)
  Top 0.203: IC3.26 24.48,46.7 v25.4,47.62 | v12.7,35.56 10.79,35.56 7.62,32.38 LCD1.16
  Bottom 0.203: v12.7,35.56 12.7,36.51 12.86,36.67 12.86,43.34 16.99,47.47 25.24,47.47 v25.4,47.62
D14  (via drill 0.4)
  Top 0.203: IC3.27 23.98,47.47 v24.77,48.26 | LCD1.17 3.17,29.84 4.45,31.11 6.99,31.11 10.79,34.92 v12.06,34.92
  Bottom 0.203: v12.06,34.92 12.06,36.51 12.38,36.83 12.38,43.5 16.83,47.94 24.45,47.94 v24.77,48.26
D15  (via drill 0.4)
  Top 0.203: IC3.28 23.48,48.24 v24.13,48.9 | LCD1.18 6.35,29.84 10.79,34.29 v11.43,34.29
  Bottom 0.203: v11.43,34.29 11.43,36.51 11.91,36.99 11.91,43.66 16.67,48.42 23.65,48.42 v24.13,48.9
GND  (via drill 0.4)
  Bottom 0.61: 11.43,2.54 64.45,2.54
  other vias: 6.99,40.01 10.16,40.01 10.16,44.45 6.35,45.72 10.16,37.47 18.41,51.44 29.84,34.29 26.67,34.29 26.67,32.38 29.84,32.38 18.41,49.53 20.95,43.81 19.68,40.01 24.77,42.55 22.86,38.73 14.61,36.83 8.89,36.83 26.67,45.72 23.5,43.81 27.94,43.81 12.06,28.57 10.79,27.3 13.34,27.3 12.06,26.04 59.69,42.23 37.47,53.98 38.73,53.98 40.01,52.7 38.73,52.7 43.81,52.7 45.09,52.7 24.77,38.73 19.68,42.55 14.92,51.12 17.78,45.09 12.7,53.98 47.62,61.59 47.62,60.33 47.62,59.05 47.62,57.78 48.26,57.15 49.53,57.15 50.8,57.15 52.07,57.15 53.34,57.15 54.61,57.15 55.88,57.15 57.15,57.15 58.42,57.15 59.69,57.15 60.96,57.15 62.23,57.15 62.87,61.59 62.87,60.33 62.87,59.05 62.87,57.78 49.53,54.93 50.8,54.93 52.07,54.93 53.34,54.93 54.61,54.93 55.88,54.93 57.15,54.93 58.42,54.93 59.69,54.93 60.96,54.93 62.23,54.93 48.26,54.93 48.26,52.7 48.26,51.44 48.26,49.53 48.26,47.62 48.26,45.09 48.26,43.81 62.23,52.7 62.23,51.44 62.23,48.9 62.23,47.62 62.23,46.35 62.23,45.09 62.23,43.81 29.84,51.12 64.77,50.16 64.77,52.7 64.77,51.44 82.55,44.45 44.45,35.56 45.72,35.56 46.99,35.56 48.26,35.56 49.53,35.56 50.8,35.56 52.07,35.56 53.34,35.56 54.61,35.56 55.88,35.56 58.42,35.56 59.69,35.56 60.96,35.56 62.23,35.56 66.04,31.75 62.87,30.48 67.31,23.5 67.31,24.77 67.31,22.23 68.58,26.04 42.23,44.13 48.26,42.55 49.53,43.18 60.96,43.18 62.23,42.55 59.69,45.4 60.96,44.45 43.18,42.55 41.91,42.55 40.64,42.55 39.37,42.55 38.1,42.55 36.83,42.55 35.56,42.55 37.47,52.7 36.2,52.7 36.2,53.98 83.82,44.45 92.08,44.45 31.11,50.8 14.92,32.07 16.19,51.44 81.28,33.02 93.34,44.45 84.45,27.94 84.45,24.77 77.47,27.94 77.47,23.5 71.12,23.5 64.77,48.9 64.77,47.62 64.77,46.35 64.77,45.09 64.77,43.81 64.77,42.55 75.56,19.05 75.56,20.32 75.56,17.78 69.85,17.78 68.58,17.78 67.31,17.78 67.31,20.95 67.31,26.04 68.58,20.95 69.85,20.95 69.85,26.04 80.33,20.64 85.72,22.86 88.27,22.86 89.53,22.86 90.81,22.86 92.08,22.86 93.34,22.86 84.45,33.02 92.08,27.94 77.47,41.91
  pour Bottom (rank 4): -1.27,63.5 96.52,63.5 96.52,-1.27 -1.27,-1.27
  pour Top (rank 4): -0.64,62.87 95.89,62.87 95.89,-0.64 -0.64,-0.64
GND-X  (via drill 0.9 pad 1.68)  (20 unrouted)
  other vias: 12.7,2.54 15.24,2.54 17.78,2.54 20.32,2.54 22.86,2.54 25.4,2.54 27.94,2.54 30.48,2.54 33.02,2.54 35.56,2.54 38.1,2.54 40.64,2.54 43.18,2.54 45.72,2.54 48.26,2.54 50.8,2.54 53.34,2.54 55.88,2.54 58.42,2.54 60.96,2.54 63.5,2.54
GPIO0  (via drill 0.4)
  Top 0.254: IC1.3 v53.34,48.26 R10.1 | v42.55,51.12 42.55,53.47 R26.1
  Bottom 0.254: v53.34,48.26 45.09,48.26 42.55,50.8 v42.55,51.12
GPIO2  (via drill 0.4)
  Top 0.254: v57.15,42.23 52.39,42.23 52.07,42.55 IC1.2 | R11.1 v57.15,34.92
  Bottom 0.254: v57.15,34.92 v57.15,42.23
LCD_BL  (via drill 0.4)
  Top 0.203: LCD1.24 7.94,25.08 7.94,27.62 11.43,31.11 v12.06,31.11 | IC3.29 22.98,49.01 v23.5,49.53
  Bottom 0.203: v23.5,49.53 22.86,48.9 16.51,48.9 11.43,43.81 11.43,37.15 10.79,36.51 10.79,32.38 v12.06,31.11
LCD_RS  (via drill 0.4)
  Top 0.203: LCD1.20 10.95,33.18 19.53,33.18 v19.68,33.02 | v24.77,34.29 24.77,34.92 23.98,35.72 IC3.10
  Bottom 0.203: v19.68,33.02 23.5,33.02 v24.77,34.29
N$1
  Top 0.203: Q1.3 83.65,20.5 R8.2
N$2
  Top 0.406: USB1.VBUS 85.39,14.91 85.09,14.61 85.09,12.7 84.52,12.13
  Top 0.813: D1.2 83.92,11.53 84.52,12.13
N$3
  Top 0.254: R2.1 LED1.A
N$4
  Top 0.203: 73.21,44.77 R25.1
  Top 0.254: R23.2 R25.1 | Q5.1 73.21,44.77
N$5
  Top 0.254: IC1.7 58.42,45.72 53.98,50.16 R6.1
N$6
  Top 0.254: R12.1 60.45,24.64 IC2.2 57.15,27.94 R11.2
N$7
  Top 0.203: SD1.4 77,35.09 76.83,34.92 L2.2
  Top 0.254: R20.2 R16.2 74.17,36.8 75.69,35.27 L2.2 75.69,34.73 74.17,33.21 C21.1 R19.2 R18.2
N$8
  Top 0.203: SD1.1 77.17,38.4 76.83,38.73 R20.1
N$9
  Top 0.203: SD1.8 76.94,30.7 76.2,31.43 R19.1
N$10
  Top 0.203: USB1.D+ 85.09,16.51 84.61,16.99 R3.1
N$11
  Top 0.254: L1.2 66.29,27.94 C8.1 65.66,27.81 C7.1 | C7.1 59.82,27.81 IC2.1 | R12.2 C7.1
N$12
  Top 0.254: SG1.- 78.31,54.33 D2.2 78.31,46.56 77.3,45.55 Q5.3
N$13  (via drill 0.9 pad 1.68)
  other vias: 60.96,5.08
N$14  (via drill 0.9 pad 1.68)
  other vias: 63.5,5.08
N$15
  Top 0.254: SG1.+ 81.71,54.33 D2.1 R24.2 R22.2
N$16
  Top 0.254: R26.2 40.51,56.9 SW2.2
N$17  (via drill 0.9 pad 1.68)
  other vias: 58.42,5.08
N$18
  Top 0.254: R30.1 JP1.1 R29.2
N$19  (via drill 0.9 pad 1.68)
  other vias: 55.88,5.08
N$20
  Top 0.254: R27.2 39.37,45.72 JP1.2 36.83,45.72 R28.1
N$21  (via drill 0.9 pad 1.68)
  other vias: 53.34,5.08
N$22  (via drill 0.9 pad 1.68)
  other vias: 50.8,5.08
N$23  (via drill 0.9 pad 1.68)
  other vias: 48.26,5.08
N$24  (via drill 0.9 pad 1.68)
  other vias: 45.72,5.08
N$25  (via drill 0.9 pad 1.68)
  other vias: 43.18,5.08
N$26  (via drill 0.9 pad 1.68)
  other vias: 40.64,5.08
N$27  (via drill 0.9 pad 1.68)
  other vias: 38.1,5.08
N$28  (via drill 0.9 pad 1.68)
  other vias: 35.56,5.08
N$29  (via drill 0.9 pad 1.68)
  other vias: 33.02,5.08
N$30  (via drill 0.9 pad 1.68)
  other vias: 30.48,5.08
N$31  (via drill 0.9 pad 1.68)
  other vias: 30.48,7.62
N$32  (via drill 0.9 pad 1.68)
  other vias: 30.48,10.16
N$33  (via drill 0.9 pad 1.68)
  other vias: 30.48,12.7
N$34  (via drill 0.9 pad 1.68)
  other vias: 33.02,12.7
N$35  (via drill 0.9 pad 1.68)
  other vias: 35.56,12.7
N$36
  Top 0.203: USB1.D- 85.08,15.71 84.77,15.4 R4.1
N$37  (via drill 0.9 pad 1.68)
  other vias: 38.1,12.7
N$38
  Top 0.203: Q1.1
  Top 0.254: Q1.1 79.57,23.81 R5.2
N$39  (via drill 0.9 pad 1.68)
  other vias: 40.64,12.7
N$40  (via drill 0.9 pad 1.68)
  other vias: 43.18,12.7
N$41  (via drill 0.9 pad 1.68)
  other vias: 45.72,12.7
N$42  (via drill 0.9 pad 1.68)
  other vias: 48.26,12.7
N$43  (via drill 0.9 pad 1.68)
  other vias: 50.8,12.7
N$44  (via drill 0.9 pad 1.68)
  other vias: 53.34,12.7
N$45  (via drill 0.9 pad 1.68)
  other vias: 55.88,12.7
N$46  (via drill 0.9 pad 1.68)
  other vias: 58.42,12.7
N$47  (via drill 0.9 pad 1.68)
  other vias: 60.96,12.7
N$48  (via drill 0.9 pad 1.68)
  other vias: 63.5,12.7
N$49  (via drill 0.9 pad 1.68)
  other vias: 63.5,10.16
N$50  (via drill 0.9 pad 1.68)
  other vias: 63.5,7.62
N$51  (via drill 0.9 pad 1.68)
  other vias: 60.96,7.62
N$52  (via drill 0.9 pad 1.68)
  other vias: 60.96,10.16
N$53  (via drill 0.9 pad 1.68)
  other vias: 58.42,10.16
N$54  (via drill 0.9 pad 1.68)
  other vias: 58.42,7.62
N$55  (via drill 0.9 pad 1.68)
  other vias: 55.88,7.62
N$56  (via drill 0.9 pad 1.68)
  other vias: 53.34,7.62
N$57  (via drill 0.9 pad 1.68)
  other vias: 50.8,7.62
N$58  (via drill 0.9 pad 1.68)
  other vias: 48.26,7.62
N$59  (via drill 0.9 pad 1.68)
  other vias: 45.72,7.62
N$60  (via drill 0.9 pad 1.68)
  other vias: 43.18,7.62
N$61  (via drill 0.9 pad 1.68)
  other vias: 40.64,7.62
N$62  (via drill 0.9 pad 1.68)
  other vias: 38.1,7.62
N$63  (via drill 0.9 pad 1.68)
  other vias: 35.56,7.62
N$64  (via drill 0.9 pad 1.68)
  other vias: 33.02,7.62
N$65  (via drill 0.9 pad 1.68)
  other vias: 33.02,10.16
N$66  (via drill 0.9 pad 1.68)
  other vias: 35.56,10.16
N$67  (via drill 0.9 pad 1.68)
  other vias: 38.1,10.16
N$68  (via drill 0.9 pad 1.68)
  other vias: 40.64,10.16
N$69  (via drill 0.9 pad 1.68)
  other vias: 43.18,10.16
N$70  (via drill 0.9 pad 1.68)
  other vias: 45.72,10.16
N$71  (via drill 0.9 pad 1.68)
  other vias: 48.26,10.16
N$72  (via drill 0.9 pad 1.68)
  other vias: 50.8,10.16
N$73  (via drill 0.9 pad 1.68)
  other vias: 53.34,10.16
N$74  (via drill 0.9 pad 1.68)
  other vias: 55.88,10.16
N$75  (via drill 0.9 pad 1.68)
  other vias: 12.7,12.7
N$76  (via drill 0.9 pad 1.68)
  other vias: 15.24,12.7
N$77  (via drill 0.9 pad 1.68)
  other vias: 17.78,12.7
N$78  (via drill 0.9 pad 1.68)
  other vias: 20.32,12.7
N$79  (via drill 0.9 pad 1.68)
  other vias: 22.86,12.7
N$80  (via drill 0.9 pad 1.68)
  other vias: 25.4,12.7
N$81  (via drill 0.9 pad 1.68)
  other vias: 27.94,12.7
N$82  (via drill 0.9 pad 1.68)
  other vias: 27.94,10.16
N$83  (via drill 0.9 pad 1.68)
  other vias: 27.94,7.62
N$84  (via drill 0.9 pad 1.68)
  other vias: 27.94,5.08
N$85  (via drill 0.9 pad 1.68)
  other vias: 25.4,5.08
N$86  (via drill 0.9 pad 1.68)
  other vias: 22.86,5.08
N$87  (via drill 0.9 pad 1.68)
  other vias: 20.32,5.08
N$88  (via drill 0.9 pad 1.68)
  other vias: 17.78,5.08
N$89  (via drill 0.9 pad 1.68)
  other vias: 12.7,5.08
N$90  (via drill 0.9 pad 1.68)
  other vias: 12.7,7.62
N$91  (via drill 0.9 pad 1.68)
  other vias: 12.7,10.16
N$92  (via drill 0.9 pad 1.68)
  other vias: 15.24,10.16
N$93  (via drill 0.9 pad 1.68)
  other vias: 17.78,10.16
N$94  (via drill 0.9 pad 1.68)
  other vias: 20.32,10.16
N$95  (via drill 0.9 pad 1.68)
  other vias: 22.86,10.16
N$96  (via drill 0.9 pad 1.68)
  other vias: 25.4,10.16
N$97  (via drill 0.9 pad 1.68)
  other vias: 25.4,7.62
N$98  (via drill 0.9 pad 1.68)
  other vias: 22.86,7.62
N$99  (via drill 0.9 pad 1.68)
  other vias: 20.32,7.62
N$100  (via drill 0.9 pad 1.68)
  other vias: 17.78,7.62
N$101  (via drill 0.9 pad 1.68)
  other vias: 15.24,7.62
N$102  (via drill 0.9 pad 1.68)
  other vias: 15.24,5.08
OSC32_IN
  Top 0.203: IC3.3 20.48,31.91 22.38,30 28.42,30 28.7,29.72 C11.1 28.89,28.89 Q2.2
OSC32_OUT
  Top 0.203: IC3.4 20.98,32.05 22.54,30.48 29.84,30.48 Q2.1 31.43,28.89 31.43,26.67 31.11,26.35 29.84,26.35 28.89,27.3 C12.1
OSC_IN
  Top 0.203: Q3.1 37.91,34.86 C13.1 37.91,30.61 37.78,30.48 32.38,30.48 31.91,30.96 22.7,30.96 21.48,32.18 IC3.5
  Bottom 0.203: R13.2 Q3.1
OSC_OUT
  Top 0.203: IC3.6 21.98,32.32 22.86,31.43 C14.1 33.21,34.86 Q3.2
  Bottom 0.203: R13.1 Q3.2
RF_RX  (via drill 0.4)
  Top 0.254: IC1.5 v55.88,45.72 | R27.1 v43.18,45.72
  Bottom 0.254: v55.88,45.72 v43.18,45.72
RF_TX  (via drill 0.4)
  Top 0.254: IC1.4 v54.61,46.35 | R29.1 42.04,48.13 v42.86,47.31
  Bottom 0.254: v54.61,46.35 43.81,46.35 v42.86,47.31
SPI1_MISO  (via drill 0.4)
  Top 0.203: IC3.16 28.55,40.02 29.84,38.73 v29.84,37.47 29.84,36.51 30.16,36.2 30.96,36.2 32.23,37.47 71.12,37.47 72.39,36.2 v73.03,36.2 | LCD1.25 3.17,19.68 4.45,20.95 5.08,20.95 arc90 6.35,22.23 6.35,22.7 8.41,24.77 8.41,27.46 11.27,30.32 14.45,30.32 15.24,31.11 v18.1,31.11 | v77.47,31.75 79.33,31.75 SD1.7
  Bottom 0.203: v18.1,31.11 18.73,30.48 27.3,30.48 27.94,31.11 27.94,36.83 28.57,37.47 v29.84,37.47 | v73.03,36.2 74.3,36.2 77.47,33.02 v77.47,31.75
SPI1_MOSI  (via drill 0.4)
  Top 0.203: IC3.17 28.69,40.52 30.48,38.73 v30.48,36.83 30.96,36.83 32.07,37.94 71.91,37.94 v72.39,37.47 | LCD1.27 3.17,17.14 4.45,18.41 7.62,18.41 8.89,19.68 8.89,27.3 11.43,29.84 14.61,29.84 15.24,30.48 v17.46,30.48 | v76.83,36.2 SD1.3
  Bottom 0.203: v17.46,30.48 17.78,30.48 18.26,30 27.46,30 28.42,30.96 28.42,36.35 28.89,36.83 v30.48,36.83 | v72.39,37.47 75.56,37.47 v76.83,36.2
SPI1_SCLK  (via drill 0.4)
  Top 0.203: IC3.15 28.42,39.52 29.21,38.73 v29.21,36.2 29.69,35.72 31.11,35.72 32.38,36.99 70.33,36.99 v71.12,36.2 | LCD1.29 3.17,14.61 4.45,15.88 5.71,15.88 9.37,19.53 9.37,27.15 11.59,29.37 16.35,29.37 v16.83,29.84 | SD1.5 77.77,33.99 v77.47,34.29
  Bottom 0.203: v16.83,29.84 17.78,29.84 18.1,29.53 27.62,29.53 28.89,30.8 28.89,35.88 v29.21,36.2 | v71.12,36.2 71.75,36.83 74.93,36.83 v77.47,34.29
SWCLK  (via drill 0.4)
  Top 0.203: IC3.37 16.93,44.02 16.03,44.93 16.03,49.37 v15.56,49.85 | v15.56,56.2 15.24,55.88 R9.1 14.1,58.17 SWD1.2
  Top 0.254: R31.2 14.92,48.58 15.56,49.21 v15.56,49.85
  Bottom 0.203: v15.56,49.85 v15.56,56.2
SWDIO  (via drill 0.4)
  Top 0.203: v16.99,56.04 17.14,55.88 R7.1 18.29,57.53 SWD1.4 | IC3.34 20.48,49.38 20,49.85 20,50.48 | v17.46,50.48 20,50.48 | R17.1 73.98,40.32 73.03,41.27 70.8,41.27 69.85,40.32 34.13,40.32 33.02,41.43 v33.02,52.7 | v20,51.44 20,50.48
  Bottom 0.203: v17.46,50.48 16.99,50.96 v16.99,56.04 | v33.02,52.7 20.95,52.7 20,51.75 v20,51.44
THERMAL  (via drill 0.9)
  other vias: 71.12,7.62 69.22,7.62 67.31,7.62 73.03,7.62 74.93,7.62 76.83,7.62 78.74,7.62 78.74,9.53 76.83,9.53 74.93,9.53 67.31,9.53 74.93,11.43 76.83,11.43 78.74,11.43 67.31,5.71 69.22,5.71 71.12,5.71 73.03,5.71 74.93,5.71 76.83,5.71 78.74,5.71 67.31,3.81 69.22,3.81 71.12,3.81 73.03,3.81 74.93,3.81 76.83,3.81 78.74,3.81 67.31,1.91 69.22,1.91 71.12,1.91 73.03,1.91 74.93,1.91 76.83,1.91 78.74,1.91 67.31,11.43
  pour Top: 65.41,12.06 80.64,12.06 80.64,1.27 65.41,1.27
  pour Bottom: 65.41,15.24 85.72,15.24 85.72,1.27 65.41,1.27
U1_RX  (via drill 0.4)
  Top 0.203: IC3.31 21.98,50.55 v22.23,50.8
  Top 0.254: R30.2 34.16,48.39 v34.29,48.26
  Bottom 0.254: v22.23,50.8 25.4,50.8 28.1,48.1 34.13,48.1 v34.29,48.26
U1_TX  (via drill 0.4)
  Top 0.203: IC3.30 22.48,49.78 v22.86,50.16
  Top 0.254: R28.2 34.16,46.86 v34.29,46.99
  Bottom 0.254: v22.86,50.16 23.02,50.32 25.24,50.32 27.94,47.62 33.66,47.62 v34.29,46.99
USB_DM  (via drill 0.4)
  Top 0.203: C2.1 R4.2 81.28,15.4 80.01,16.67 v80.01,17.78 | IC3.32 21.48,51.32 v21.59,51.44 | v31.75,51.44 32.07,51.12 32.07,41.12 33.81,39.37 71.12,39.37 v71.75,40.01
  Bottom 0.203: v21.59,51.44 21.91,51.75 31.43,51.75 v31.75,51.44 | v80.01,17.78 80.01,19.05 82.55,21.59 82.55,38.1 80.17,40.48 73.66,40.48 73.5,40.64 72.39,40.64 v71.75,40.01
USB_DP  (via drill 0.4)
  Top 0.203: R8.1 C4.1 R3.2 v80.64,16.99 | IC3.33 20.98,49.83 v20.64,50.16 | v32.38,52.07 32.38,51.59 32.54,51.44 32.54,41.27 33.97,39.85 70.33,39.85 v71.12,40.64
  Bottom 0.203: v20.64,50.16 20.64,51.75 21.11,52.23 32.23,52.23 v32.38,52.07 | v80.64,16.99 80.64,19.05 83.03,21.43 83.03,38.26 80.33,40.96 73.82,40.96 73.66,41.12 71.6,41.12 v71.12,40.64
VBAT  (via drill 0.4)
  Top 0.203: IC3.1 19.48,35.03 v19.05,34.61 | v14.61,27.3 14.61,26.04 12.22,23.65 G1.+
  Bottom 0.203: v19.05,34.61 19.05,33.97 14.61,29.53 v14.61,27.3

### Text on the board
tPlace: tuxotronic.org/lcd32m | Rev.A/1 2015-06-01 | +5V | +3V3 | +3V3 | +5V | GND
bPlace: RESET | SETUP | RFRX | UTX | RFTX | URX